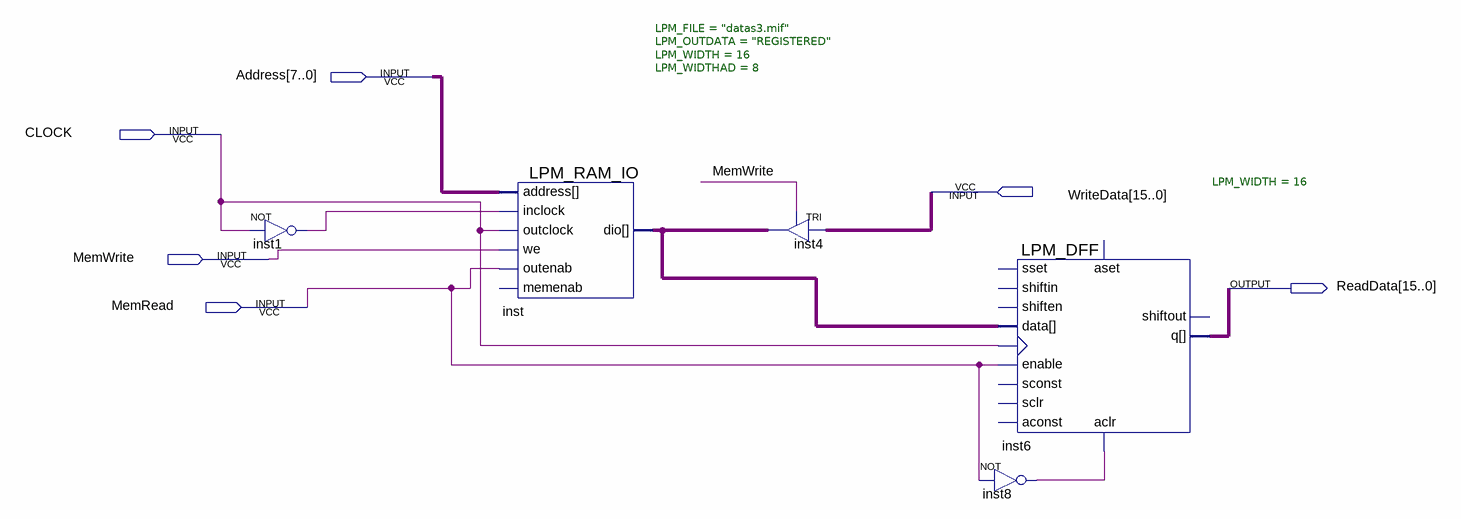
[diagram p0: schematic sheet]
// Quartus schematic DataMemory.bdf as structural Verilog: 5 symbols, 6 pins
module DataMemory (
  input  [7:0] Address,
  input  CLOCK,
  input  [15:0] WriteData,
  input  MemWrite,
  input  MemRead,
  output [15:0] ReadData
);

  wire inst1_out, inst8_out;
  wire [15:0] inst_dio;

  not inst1 (inst1_out, CLOCK);
  LPM_RAM_IO #(.LPM_FILE("datas3.mif"), .LPM_OUTDATA("REGISTERED"), .LPM_WIDTH(16), .LPM_WIDTHAD(8)) inst (
    .address(Address), .outclock(CLOCK), .inclock(inst1_out), .we(MemWrite), .outenab(MemRead), .dio(inst_dio));  // open: memenab
  TRI inst4[15:0] (.IN(WriteData), .OE(MemWrite), .OUT(inst_dio));
  LPM_DFF #(.LPM_WIDTH(16)) inst6 (
    .enable(MemRead), .clock(CLOCK), .data(inst_dio), .aclr(inst8_out), .q(ReadData));  // open: shiftin, shiften, aconst, sclr, sconst, sset, aset, shiftout
  not inst8 (inst8_out, MemRead);
endmodule
